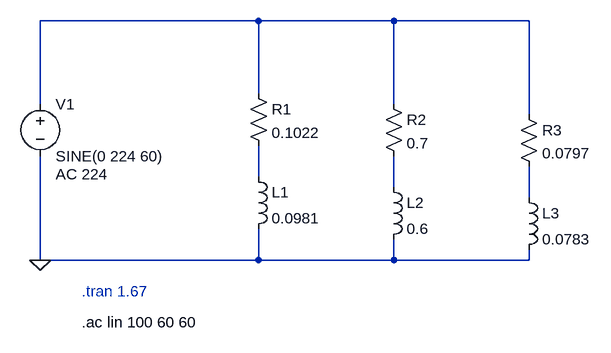
[diagram p0: schematic MARCOS_ANTONIO_TOME_OLIVERA3.asc]
MARCOS_ANTONIO_TOME_OLIVERA3.asc, the LTspice schematic file:
Version 4.1
SHEET 1 904 680
WIRE 384 0 48 0
WIRE 592 0 384 0
WIRE 800 0 592 0
WIRE 384 112 384 0
WIRE 48 128 48 0
WIRE 592 128 592 0
WIRE 800 144 800 0
WIRE 384 240 384 192
WIRE 592 256 592 208
WIRE 800 272 800 224
WIRE 48 368 48 208
WIRE 384 368 384 320
WIRE 384 368 48 368
WIRE 592 368 592 336
WIRE 592 368 384 368
WIRE 800 368 800 352
WIRE 800 368 592 368
FLAG 48 368 0
SYMBOL voltage 48 112 R0
WINDOW 123 24 124 Left 2
WINDOW 39 0 0 Left 0
SYMATTR InstName V1
SYMATTR Value SINE(0 224 60)
SYMATTR Value2 AC 224
SYMBOL res 368 96 R0
SYMATTR InstName R1
SYMATTR Value 0.1022
SYMBOL ind 368 224 R0
SYMATTR InstName L1
SYMATTR Value 0.0981
SYMBOL ind 576 240 R0
SYMATTR InstName L2
SYMATTR Value 0.6
SYMBOL res 576 112 R0
SYMATTR InstName R2
SYMATTR Value 0.7
SYMBOL res 784 128 R0
SYMATTR InstName R3
SYMATTR Value 0.0797
SYMBOL ind 784 256 R0
SYMATTR InstName L3
SYMATTR Value 0.0783
TEXT 112 416 Left 2 ;.tran 1.67
TEXT 112 464 Left 2 !.ac lin 100 60 60

The netlist it stands for:
* MARCOS_ANTONIO_TOME_OLIVERA3.asc
V1 N001 0 SINE(0 224 60) AC 224
R1 N001 N002 0.1022
L1 N002 0 0.0981
L2 N003 0 0.6
R2 N001 N003 0.7
R3 N001 N004 0.0797
L3 N004 0 0.0783
* .tran 1.67
.ac lin 100 60 60
.backanno
.end